# EAGLE design Piggyback-Board (EAGLE 6.1)
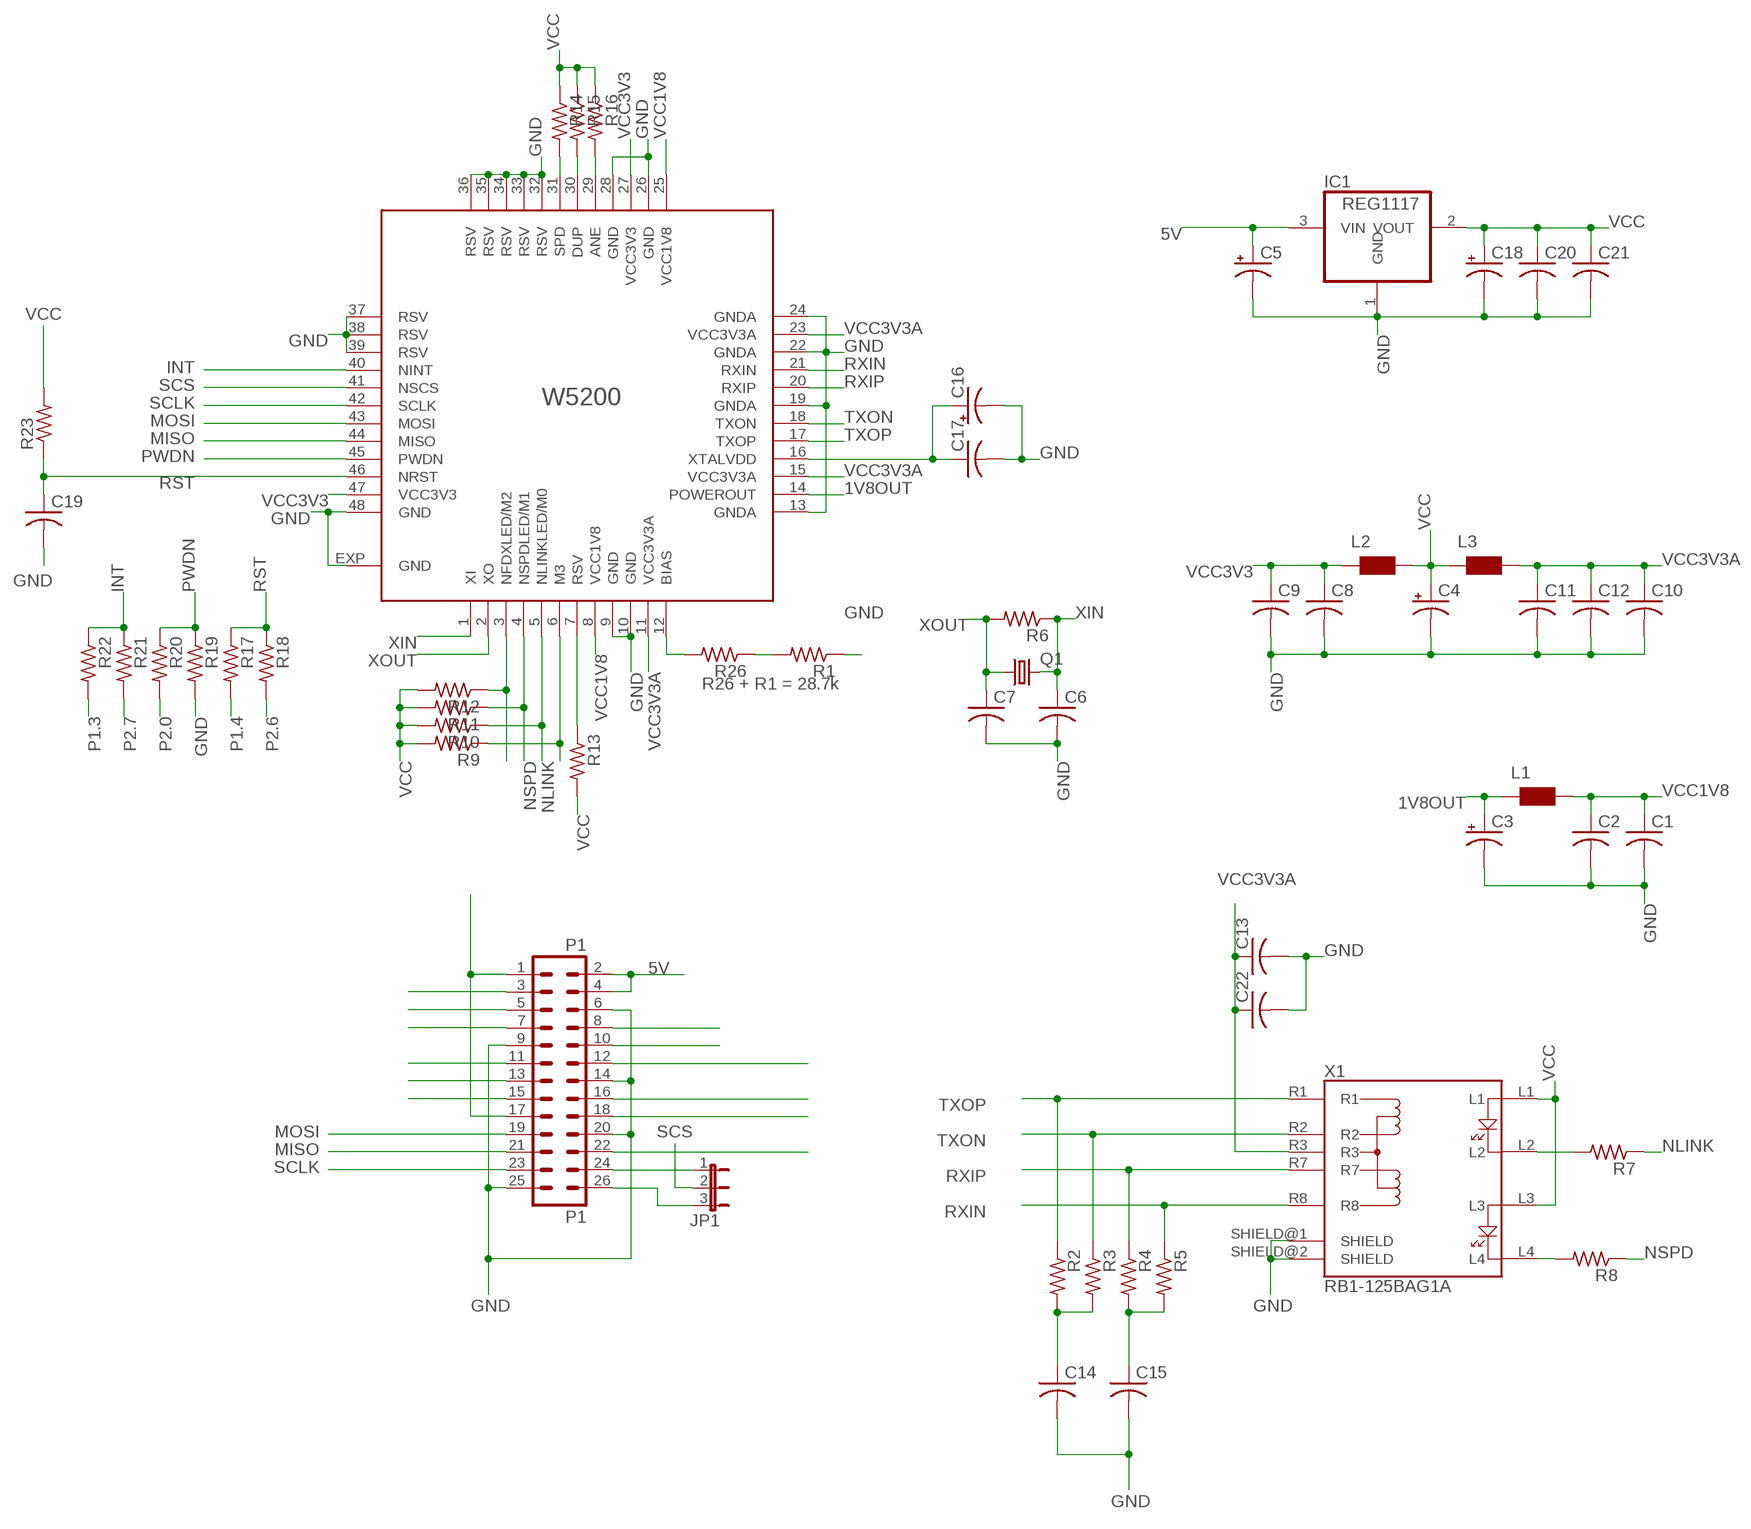
[diagram p0: schematic, sheet 1]

## Parts
C1  C-USC0603  [C0603]
C2  C-USC0603  [C0603]
C3  CPOL-USA/3216-18R  [A/3216-18R]
C4  CPOL-USA/3216-18R  [A/3216-18R]
C5  CPOL-USB/3528-21R  [B/3528-21R]
C6  C-USC0603  [C0603]
C7  C-USC0603  [C0603]
C8  C-USC0603  [C0603]
C9  C-USC0603  [C0603]
C10  C-USC0603  [C0603]
C11  C-USC0603  [C0603]
C12  C-USC0603  [C0603]
C13  C-USC0603  [C0603]
C14  C-USC0603  [C0603]
C15  C-USC0603  [C0603]
C16  CPOL-USA/3216-18R  [A/3216-18R]
C17  C-USC0603  [C0603]
C18  CPOL-USB/3528-21R  [B/3528-21R]
C19  C-USC0603  [C0603]
C20  C-USC0603  [C0603]
C21  C-USC0603  [C0603]
C22  C-USC0603  [C0603]
IC1  REG1117  [SOT223]
JP1  JP2E  [JP2]
L1  WE-CBF_0603  [0603]
L2  WE-CBF_0603  [0603]
L3  WE-CBF_0603  [0603]
P1  P1  MA13-2  [MA13-2]
Q1  CRYSTALSM49  [SM49]
R1  R-US_R0603  [R0603]
R2  R-US_R0603  [R0603]
R3  R-US_R0603  [R0603]
R4  R-US_R0603  [R0603]
R5  R-US_R0603  [R0603]
R6  R-US_R0603  [R0603]
R7  R-US_R0603  [R0603]
R8  R-US_R0603  [R0603]
R9  R-US_R0603  [R0603]
R10  R-US_R0603  [R0603]
R11  R-US_R0603  [R0603]
R12  R-US_R0603  [R0603]
R13  R-US_R0603  [R0603]
R14  R-US_R0603  [R0603]
R15  R-US_R0603  [R0603]
R16  R-US_R0603  [R0603]
R17  R-US_R0603  [R0603]
R18  R-US_R0603  [R0603]
R19  R-US_R0603  [R0603]
R20  R-US_R0603  [R0603]
R21  R-US_R0603  [R0603]
R22  R-US_R0603  [R0603]
R23  R-US_R0603  [R0603]
R26  R-US_R0603  [R0603]
W5200  W5200  [QFN48]
X1  RB1-125BAG1A  [RB1-125BAG1A]

## Nets
1V8OUT: C3.+ L1.1 W5200.14(POWEROUT)
5V: C5.+ IC1.3(VIN) P1.2 P1.4
BIAS: R26.2 W5200.12(BIAS)
GND: C1.2 C2.2 C3.- C4.- C5.- C6.2 C7.2 C8.2 C9.2 C10.2 C11.2 C12.2 C13.2 C14.2 C15.2 C16.- C17.2 C18.- C19.2 C20.2 C21.2 C22.2 IC1.1(GND) P1.6 P1.9 P1.14 P1.20 P1.25 R1.1 R19.2 W5200.9(GND) W5200.10(GND) W5200.13(GNDA) W5200.19(GNDA) W5200.22(GNDA) W5200.24(GNDA) W5200.26(GND) W5200.28(GND) W5200.32(RSV) W5200.33(RSV) W5200.34(RSV) W5200.35(RSV) W5200.36(RSV) W5200.37(RSV) W5200.38(RSV) W5200.39(RSV) W5200.48(GND) W5200.EXP(GND) X1.SHIELD@1(SHIELD) X1.SHIELD@2(SHIELD)
INT: R21.1 R22.1 W5200.40(NINT)
M2: R12.1 W5200.3(NFDXLED/M2)
M3: R9.1 W5200.6(M3)
MISO: P1.21 W5200.44(MISO)
MOSI: P1.19 W5200.43(MOSI)
N$1: JP1.1 P1.24
N$2: JP1.3 P1.26
N$3: P1.22
N$4: P1.18
N$5: P1.16
N$6: P1.1 P1.17
N$7: P1.15
N$8: P1.13
N$9: R1.2 R26.1
N$10: P1.11
N$11: P1.12
N$12: P1.10
N$13: P1.8
N$14: P1.7
N$15: P1.5
N$16: P1.3
N$21: R7.2 X1.L2
N$22: R8.2 X1.L4
N$30: R14.2 W5200.31(SPD)
N$31: R15.2 W5200.30(DUP)
N$32: C14.1 R2.2 R3.2
N$33: C15.1 R4.2 R5.2
N$34: R16.2 W5200.29(ANE)
NLINK: R7.1 R10.1 W5200.5(NLINKLED/M0)
NSPD: R8.1 R11.1 W5200.4(NSPDLED/M1)
P1.3: R22.2
P1.4: R17.2
P2.0: R20.2
P2.6: R18.2
P2.7: R21.2
PWDN: R19.1 R20.1 W5200.45(PWDN)
RST: C19.1 R17.1 R18.1 R23.1 W5200.46(NRST)
RSV: R13.1 W5200.7(RSV)
RXIN: R5.1 W5200.21(RXIN) X1.R8
RXIP: R4.1 W5200.20(RXIP) X1.R7
SCLK: P1.23 W5200.42(SCLK)
SCS: JP1.2 W5200.41(NSCS)
TXON: R3.1 W5200.18(TXON) X1.R2
TXOP: R2.1 W5200.17(TXOP) X1.R1
VCC: C4.+ C18.+ C20.1 C21.1 IC1.2(VOUT) L2.2 L3.1 R9.2 R10.2 R11.2 R12.2 R13.2 R14.1 R15.1 R16.1 R23.2 X1.L1 X1.L3
VCC1V8: C1.1 C2.1 L1.2 W5200.8(VCC1V8) W5200.25(VCC1V8)
VCC3V3: C8.1 C9.1 L2.1 W5200.27(VCC3V3) W5200.47(VCC3V3)
VCC3V3A: C10.1 C11.1 C12.1 C13.1 C22.1 L3.2 W5200.11(VCC3V3A) W5200.15(VCC3V3A) W5200.23(VCC3V3A) X1.R3
XIN: C6.1 Q1.2 R6.1 W5200.1(XI)
XOUT: C7.1 Q1.1 R6.2 W5200.2(XO)
XTALVDD: C16.+ C17.1 W5200.16(XTALVDD)

## Notes on the sheet
- R26 + R1 = 28.7k

## Library data of the parts
C1 C2 C6-C15 C17 C19-C22 = rcl:C-US: CAPACITOR, American symbol
C3-C5 C16 C18 = rcl:CPOL-US: POLARIZED CAPACITOR, American symbol
IC1 = burr-brown:REG1117: 800mA and 1A Low Dropout (LDO) Positive Regulator 1.8V, 2.5V, 2.85V, 3.3V, 5V, and Adj
JP1 = jumper:JP2E: JUMPER
L1-L3 = wuerth-elektronik:WE-CBF: SMD EMI Suppression Ferrite Beads - excellent anti-EMI properties - low DCR - impedances till 3000 ohms - rated current up to 6 A
P1 = con-lstb:MA13-2: PIN HEADER; OC_FARNELL: unknown; OC_NEWARK: unknown
Q1 = crystal:CRYSTAL: CRYSTAL
R1-R23 R26 = rcl:R-US_: RESISTOR, American symbol
W5200 = Rob's Library:W5200
X1 = Rob's Library:RB1-125BAG1A: MagJack RB1-125BAG1A

## Board
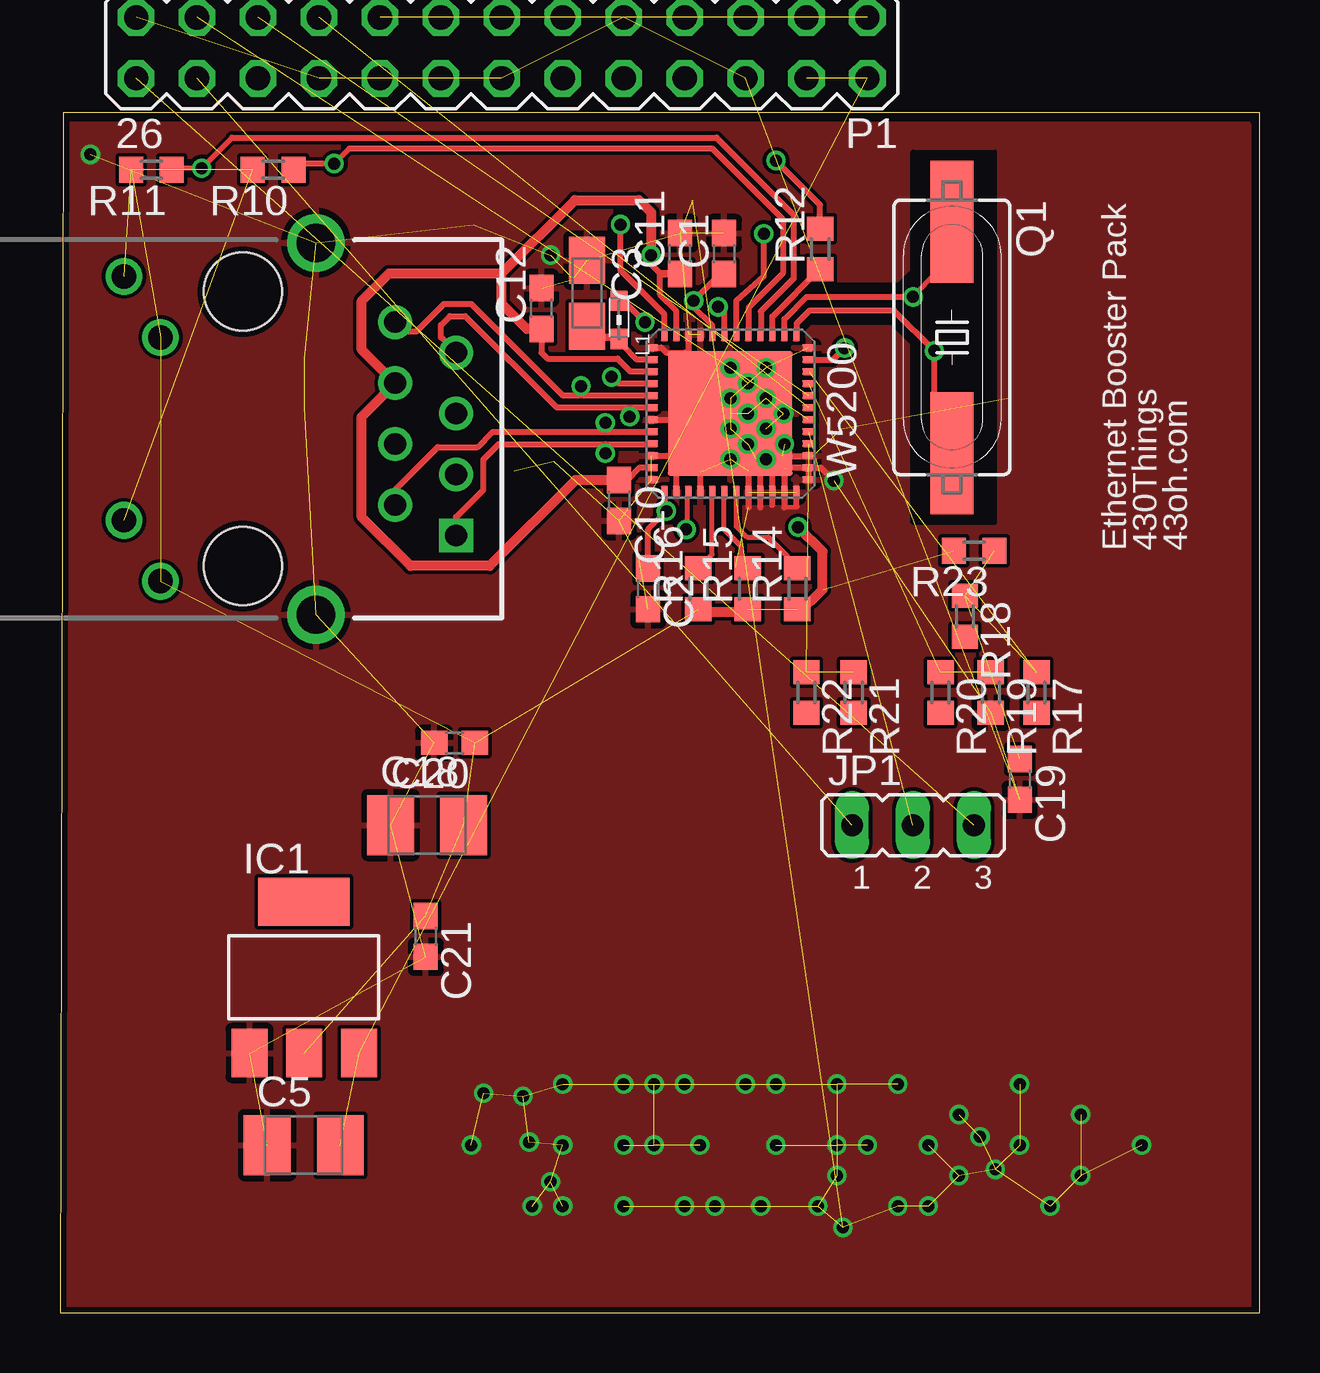
[diagram p1: board, top side]
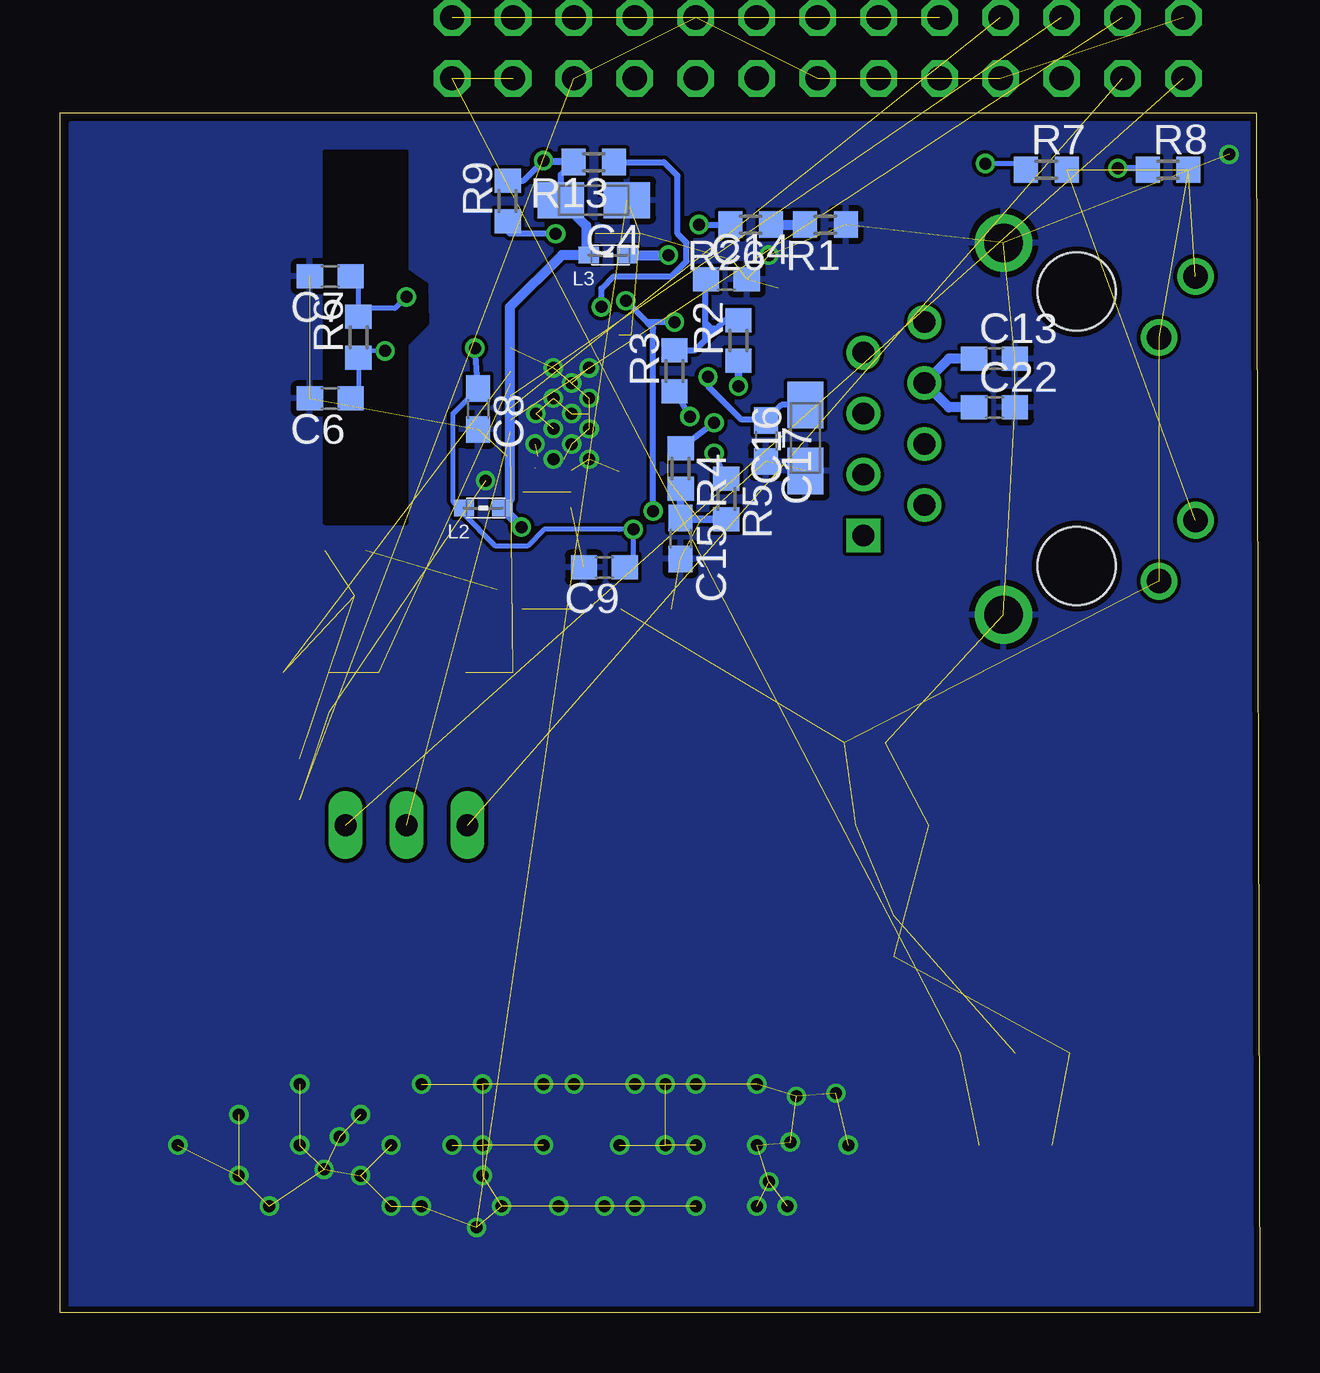
[diagram p2: board, bottom side, seen from below]

Size 50 x 50 mm. Coordinates in mm from the lower left corner, seen from the top.
Outline: 0,0 50,0 50,50 0.13,50 0,0
Copper layers (1*16): Top 0.035mm / dielectric 1.5mm / Bottom 0.035mm
Design rules: minimum track width 6mil, minimum drill 12mil, track to track 6mil, track to pad 6mil, pad to pad 6mil, via to via 6mil, smd to smd 0mil, copper to edge 10mil, drill to drill 10mil, minimum pad ring 10mil, minimum via ring 6mil, stop-mask expansion 2mil, vias tented up to drill 100mil, thermal gap 10mil
tRestrict: area 29.9,32.9 to 39,48.4
bRestrict: area 34.7,32.9 to 39,48.4

### Footprints (pad centres in the part's own frame; a part is rotated, then mirrored left to right if it is on the bottom)
C0603 = smd 1.1 x 1: 1 -0.85,0; 2 0.85,0
A/3216-18R = smd 1.95 x 1.5: + 1.375,0; - -1.375,0
B/3528-21R = smd 1.95 x 2.5: + 1.525,0; - -1.525,0
SOT223 = smd 1.499 x 2.007: 1 -2.261,-3.15; 2 0.025,-3.15; 3 2.311,-3.15 | smd 3.81 x 2.007: 4 0,3.15
JP2 = drill 0.914 long: 1 -2.54,0; 2 0,0; 3 2.54,0
0603 = smd 0.85 x 0.7: 1 -0.9,0; 2 0.7,0
MA13-2 = drill 1.016 octagon: 1 -15.24,-1.27; 2 -15.24,1.27; 3 -12.7,-1.27; 4 -12.7,1.27; 5 -10.16,-1.27; 6 -10.16,1.27; 7 -7.62,-1.27; 8 -7.62,1.27; 9 -5.08,-1.27; 10 -5.08,1.27; 11 -2.54,-1.27; 12 -2.54,1.27; 13 0,-1.27; 14 0,1.27; 15 2.54,-1.27; 16 2.54,1.27; 17 5.08,-1.27; 18 5.08,1.27; 19 7.62,-1.27; 20 7.62,1.27; 21 10.16,-1.27; 22 10.16,1.27; 23 12.7,-1.27; 24 12.7,1.27; 25 15.24,-1.27; 26 15.24,1.27
SM49 = smd 5.08 x 1.778: 1 -4.826,0; 2 4.826,0
R0603 = smd 1 x 1.1: 1 -0.85,0; 2 0.85,0
QFN48 = smd 0.55 x 0.3: 1 -3.275,2.75; 2 -3.275,2.25; 3 -3.275,1.75; 4 -3.275,1.25; 5 -3.275,0.75; 6 -3.275,0.25; 7 -3.275,-0.25; 8 -3.275,-0.75; 9 -3.275,-1.25; 10 -3.275,-1.75; 11 -3.275,-2.25; 12 -3.275,-2.75; 25 3.275,-2.75; 26 3.275,-2.25; 27 3.275,-1.75; 28 3.275,-1.25; 29 3.275,-0.75; 30 3.275,-0.25; 31 3.275,0.25; 32 3.275,0.75; 33 3.275,1.25; 34 3.275,1.75; 35 3.275,2.25; 36 3.275,2.75 | smd 0.3 x 0.55: 13 -2.75,-3.275; 14 -2.25,-3.275; 15 -1.75,-3.275; 16 -1.25,-3.275; 17 -0.75,-3.275; 18 -0.25,-3.275; 19 0.25,-3.275; 20 0.75,-3.275; 21 1.25,-3.275; 22 1.75,-3.275; 23 2.25,-3.275; 24 2.75,-3.275; 37 2.75,3.275; 38 2.25,3.275; 39 1.75,3.275; 40 1.25,3.275; 41 0.75,3.275; 42 0.25,3.275; 43 -0.25,3.275; 44 -0.75,3.275; 45 -1.25,3.275; 46 -1.75,3.275; 47 -2.25,3.275; 48 -2.75,3.275 | smd 5.207 x 5.207: EXP 0,0
RB1-125BAG1A = drill 1.02: L1 6.35,-3.429; L2 3.81,-4.953; L3 -3.81,-3.429; L4 -6.35,-4.953 | drill 0.9: R1 -4.445,6.35; R2 -3.175,8.89; R3 -1.905,6.35; R4 -0.635,8.89; R5 0.635,6.35; R6 1.905,8.89; R7 3.175,6.35 | drill 0.9 square: R8 4.445,8.89 | drill 1.6: SHIELD@1 -7.747,3.048; SHIELD@2 7.747,3.048 | hole 3.25: 5.715,0; -5.715,0

### Placement (x,y rotation side)
C1  27.69,44.13 90 top
C2  24.51,30.16 270 top
C3  21.97,42.48 270 top
C4  27.75,46.35 180 bottom
C5  10.16,6.99 0 top
C6  38.73,38.1 180 bottom
C7  38.73,43.18 180 bottom
C8  32.58,37.66 270 bottom
C9  27.3,31.05 180 bottom
C10  23.3,33.85 270 top
C11  25.84,44.13 90 top
C12  20.07,41.85 90 top
C13  11.05,39.75 0 bottom
C14  22.23,43.05 0 bottom
C15  24.13,32.26 270 bottom
C16  18.92,36.45 90 bottom
C17  20.57,36.32 270 bottom
C18  15.3,20.32 0 top
C19  40.01,22.23 270 top
C20  16.45,23.75 180 top
C21  15.24,15.68 270 top
C22  11.05,37.72 0 bottom
IC1  10.16,13.97 0 top
JP1  35.56,20.32 0 top
L1  23.3,41.47 90 top
L2  32.26,33.53 0 bottom
L3  27.05,44.07 0 bottom
P1  18.41,52.7 180 top
Q1  37.18,40.64 270 top
R1  18.1,45.34 180 bottom
R2  21.72,40.51 90 bottom
R3  24.38,39.24 90 bottom
R4  24.13,35.18 270 bottom
R5  22.23,33.91 270 bottom
R6  37.56,40.64 90 bottom
R7  8.89,47.62 0 bottom
R8  3.81,47.62 0 bottom
R9  31.34,46.32 90 bottom
R10  8.89,47.62 180 top
R11  3.81,47.62 180 top
R12  31.69,44.32 90 top
R13  27.75,47.94 180 bottom
R14  30.73,30.16 90 top
R15  28.67,30.16 90 top
R16  26.61,30.16 90 top
R17  40.7,25.84 270 top
R18  37.72,29.02 270 top
R19  38.8,25.84 270 top
R20  36.7,25.84 270 top
R21  33.08,25.84 270 top
R22  31.11,25.84 270 top
R23  38.1,31.75 180 top
R26  21.21,45.34 180 bottom
W5200  27.94,37.47 270 top
X1  7.62,36.83 270 top

### Tracks (layer width: path | path; a pad name or v marks a point on that pad's centre or on a via)
1V8OUT
  Top 0.254: W5200.14 24.04,39.72 23.44,40.31 | C3.+ 21.97,40.64
  Top 0.305: 21.97,40.64 23.1,40.64 L1.1 23.44,40.31
5V  (3 unrouted)
BIAS  (via drill 0.5)
  Top 0.254: W5200.12 25.19,41.61 23.37,43.43 v23.37,45.34
  Bottom 0.254: v23.37,45.34 22.35,45.34
  Bottom 0.406: R26.2 22.35,45.34
GND  (via drill 0.5)  (98 unrouted)
  Top 0.203: 27.88,39.43 v27.94,39.37 26.7,39.81 26.19,39.85 | 30.7,34.26 W5200.36 | v29.43,35.56 29.18,35.02 | v29.43,35.56 30.19,35.18 | 28.7,35.08 29.02,35.56 v29.43,35.56 | 30.19,33.56 30.7,33.59 | 29.69,35.18 v29.43,35.56
  Top 0.254: 25.65,35.69 25.65,36.32 25.72,37.21 25.71,37.22 W5200.19 | 31.37,35.69 W5200.39 31.11,35.69 30.1,35.69 v29.43,35.56 | 28.7,35.08 28.7,33.56 | 29.18,35.02 29.18,33.56 | 29.69,35.18 29.69,33.66 | 30.19,35.18 30.19,33.56 | 30.7,33.59 30.7,34.26 | W5200.10 26.19,39.85 | 26.19,39.85 | W5200.13 25.06,40.22 25.27,40.01 26.04,40.01 26.19,39.85 | W5200.22 25.63,35.72 25.65,35.69 | W5200.38 30.26,35.22 30.23,35.18 | W5200.37 W5200.38 | W5200.38 31.71,35.22 v32.26,34.67 | W5200.26 25.69,35.14 | 25.69,35.14 25.65,35.18 25.65,35.69 | W5200.28 26.69,35.03 26.54,35.18 26.51,35.14 25.69,35.14
  other vias: 27.94,36.83 29.43,36.83 27.94,38.1 29.43,38.1 29.43,39.37 27.94,35.56 28.67,38.73 28.67,37.46 28.67,36.2 19.68,4.45 17.14,6.99 24.77,9.53 27.3,4.45 19.3,9.02 45.09,6.99 40.01,6.99 40.01,9.53 37.47,5.71 42.55,5.71 41.27,4.45 32.38,5.71 17.65,9.14 19.56,7.11 20.45,5.46 29.21,4.45 32.64,3.56 26.67,6.99 31.59,4.45 34.92,4.45 32.38,9.53 36.2,4.45 30.19,36.2 30.16,37.47 38.35,7.33 26.04,4.45 23.5,4.45 20.95,4.45 20.95,6.99 20.95,9.53 23.5,6.99 23.5,9.53 34.92,9.53 29.84,6.99 28.57,9.53 26.04,9.53 24.77,6.99 32.38,6.99 29.84,9.53 36.2,6.99 33.66,6.99 37.47,8.26 42.55,8.26 1.27,48.26 20.45,44.07 38.99,5.97
  pour Top: 0.13,49.53 49.53,49.53 49.53,0 0,0
  pour Bottom: 0.13,49.53 49.53,49.53 49.53,0 0,0
INT  (2 unrouted)
M2
  Top 0.254: W5200.3 29.69,41.5 31.69,43.5 | 31.69,43.5 31.75,43.56 | R12.1 31.69,43.5
M3  (via drill 0.5)
  Top 0.254: W5200.6 28.19,42.16 29.34,43.18 v29.34,44.96
  Bottom 0.254: v29.34,44.96 31.24,44.96 31.34,45.05 R9.1
MISO  (1 unrouted)
MOSI  (1 unrouted)
N$1  (1 unrouted)
N$2  (1 unrouted)
N$6  (1 unrouted)
N$9
  Bottom 0.406: R26.1 R1.2
N$21  (1 unrouted)
N$22  (1 unrouted)
N$30
  Top 0.203: W5200.31 28.19,33.91 28.19,32.77 28.64,32.32 29.53,32.32 30.32,31.53 30.32,31.37 R14.2
N$31
  Top 0.203: R15.2 28.38,31.37 28.38,31.94 27.69,32.64 27.69,33.91 W5200.30
N$32
  Bottom 0.254: R3.2 23.53,40.09 23.11,40.51 | 23.11,40.51 22.86,40.77 | 22.86,40.77 22.61,41.02 | 22.61,41.02 22.26,41.36 R2.2 | C14.1 23.07,42.84 23.11,42.8 23.11,41.27 | 23.11,41.27 23.11,41.02 | 23.11,41.02 23.11,40.51 | 22.86,40.77 23.11,41.02 | 23.11,41.27 22.86,41.02 22.61,41.02
N$33
  Bottom 0.305: R4.2 C15.1 24.13,33.15 24.04,33.06 R5.2
N$34
  Top 0.203: W5200.29 27.18,33.97 27.18,31.59 R16.2
NLINK  (via drill 0.5)
  Top 0.203: v11.43,47.88 12.06,48.51 | 28.7,40.89 W5200.5
  Top 0.254: 12.06,48.51 27.18,48.51 30.13,45.56 30.13,43.31 28.7,41.88 28.7,40.89 | v11.43,47.88 9.97,47.88 R7.1
  Bottom 0.203: R7.1 9.91,47.88 v11.43,47.88
NSPD  (via drill 0.5)
  Top 0.203: 5.08,47.69 v5.91,47.69 7.18,48.96 | 29.21,40.89 W5200.4
  Top 0.254: 7.18,48.96 27.37,48.96 30.57,45.75 30.57,43.09 29.21,41.72 29.21,40.89 | 5.08,47.69 R8.1
  Bottom 0.254: R8.1 4.95,47.69 v5.91,47.69
PWDN  (2 unrouted)
RST  (4 unrouted)
RSV  (via drill 0.5)
  Top 0.254: W5200.7 27.69,41.65 v27.43,41.91
  Bottom 0.254: v27.43,41.91 27.43,42.67 26.92,43.18 24.51,43.18 23.88,43.81 23.88,44.58 24.26,44.96 24.26,47.37 24.83,47.94 R13.1
RXIN  (via drill 0.5)
  Top 0.254: X1.R8 16.51,33.15 17.65,34.29 17.65,35.56 18.29,36.2 22.73,36.2 | 22.73,36.2 24.51,36.2 W5200.21 | v22.73,35.81 22.73,36.2
  Bottom 0.254: R5.1 v22.73,35.81
RXIP  (via drill 0.5)
  Top 0.254: 22.73,36.7 18.03,36.7 17.4,36.07 15.75,36.07 13.97,34.29 X1.R7 | 22.73,36.7 24.57,36.7 W5200.20 | v22.73,37.08 22.73,36.7
  Bottom 0.254: R4.1 v22.73,37.08
SCLK  (1 unrouted)
SCS  (1 unrouted)
TXON  (via drill 0.5)
  Top 0.254: X1.R2 15.88,40.64 15.88,41.15 16.26,41.53 16.89,41.53 20.7,37.72 23.75,37.72 | 23.75,37.72 24.51,37.72 W5200.18 | v23.75,37.34 23.75,37.72
  Bottom 0.254: R3.1 v23.75,37.34
TXOP  (via drill 0.5)
  Top 0.254: 21.72,38.23 20.95,38.23 17.14,42.04 16,42.04 14.86,40.89 14.35,40.89 X1.R1 | 21.72,38.23 24.51,38.23 W5200.17 | v21.72,38.61 21.72,38.23
  Bottom 0.305: R2.1 v21.72,38.61
VCC  (via drill 0.5)  (10 unrouted)
  Top 0.203: R16.1 27.11,29.21
  Top 0.254: R12.2 31.69,46.16 v29.84,48.01
  Top 0.406: 27.11,29.21 28.38,29.21 R15.1 | R14.1 31.34,29.69 31.78,30.13 31.78,31.72 v30.77,32.73
  Bottom 0.254: v29.84,48.01 28.83,48.01 | v29.84,48.01 29.78,47.94 R13.2 29.12,47.42 C4.+ | R9.2 30.68,47.17 v29.84,48.01
  Bottom 0.406: v30.77,32.73 L2.2 31.24,33.91 31.24,38.7 31.24,41.91 29.08,44.07 28.07,44.07 | 28.07,44.07 L3.1 | C4.+ 28.07,45.3 28.07,44.07
VCC1V8  (via drill 0.5)
  Top 0.254: L1.2 23.49,42.17 v24.38,41.27 | C1.1 27.69,43.43 v26.42,42.16 26.42,41.91 27.19,41.14 W5200.8 | W5200.25 25.19,33.48 v25.27,33.4 24.51,32.64 C2.1
  Bottom 0.254: v24.38,41.27 25.53,41.27 | 25.53,41.27 v26.42,42.16 | v25.27,33.4 25.27,41.02 25.53,41.27
VCC3V3  (via drill 0.5)
  Top 0.203: W5200.27 26.16,33.97 26.16,32.83 v26.1,32.64
  Top 0.254: W5200.47 31.37,39.69 32.2,39.69 v32.7,40.2
  Bottom 0.203: C9.1 26.1,31.3 v26.1,32.64 26.7,32.64 29.81,32.64 30.51,31.94 31.84,31.94 33.23,33.33 33.62,33.81 33.62,37.15 33.62,37.47 C8.1
  Bottom 0.254: C8.1 v32.7,40.2 | 33.23,33.33 L2.1
VCC3V3A  (via drill 0.5)
  Top 0.254: C12.1 20.07,40.01 20.32,39.75 23.24,39.75 23.78,39.22 W5200.15 | 25.04,43.28 25.02,43.31 | 25.02,43.31 24.64,43.69 v24.64,44.07 | W5200.11 25.69,41.75 25.02,42.42 25.02,43.31 | W5200.23 24.17,35.22 23.65,34.7 C10.1
  Top 0.305: C11.1 25.04,43.28
  Top 0.406: C12.1 19.46,41 18.41,42.04 18.41,43.31 | 18.41,43.31 21.46,46.35 24.13,46.35 24.64,45.85 v24.64,44.07 | 18.41,43.31 13.72,43.31 12.57,42.16 12.57,40.13 X1.R3 12.57,37.34 12.57,33.15 14.61,31.11 17.91,31.11 21.49,34.7 C10.1
  Bottom 0.406: C22.1 12.95,37.72 X1.R3 12.95,39.75 C13.1 | L3.2 v24.64,44.07
XIN  (via drill 0.5)
  Top 0.203: Q1.2 36.45,38.32
  Top 0.254: W5200.1 30.7,40.86 30.7,41.21 31.24,41.75 34.77,41.75 v36.45,40.08 36.45,38.32
  Bottom 0.203: C6.1 37.56,38.29 R6.1 | v36.45,40.08 37.4,40.07 37.66,39.69
  Bottom 0.254: 37.91,39.62 37.78,39.69 R6.1 37.91,39.62 | 37.66,39.69 37.91,39.62
XOUT  (via drill 0.5)
  Top 0.203: W5200.2 30.19,40.93 | v35.56,42.32 36.58,43.37 Q1.1
  Top 0.254: 30.19,40.93 30.19,41.4 31.11,42.32 v35.56,42.32
  Bottom 0.203: 37.56,41.72 37.56,42.93 C7.1 | 37.56,41.72 R6.2 | v35.56,42.32 36.04,41.85 37.66,41.85 37.56,41.72
XTALVDD  (via drill 0.5)
  Top 0.254: W5200.16 23.26,38.72 v22.99,38.99
  Bottom 0.254: v22.99,38.99 22.99,38.61 21.59,37.21 20.7,37.21 | C16.+ 19.92,37.82 C17.1
  Bottom 0.305: C17.1 20.66,37.17 20.7,37.21

### Text on the board
tNames: Ethernet Booster Pack | 430Things | 43oh.com